# EAGLE design Analog-Mux-Breakout-v10 (EAGLE 6.2)
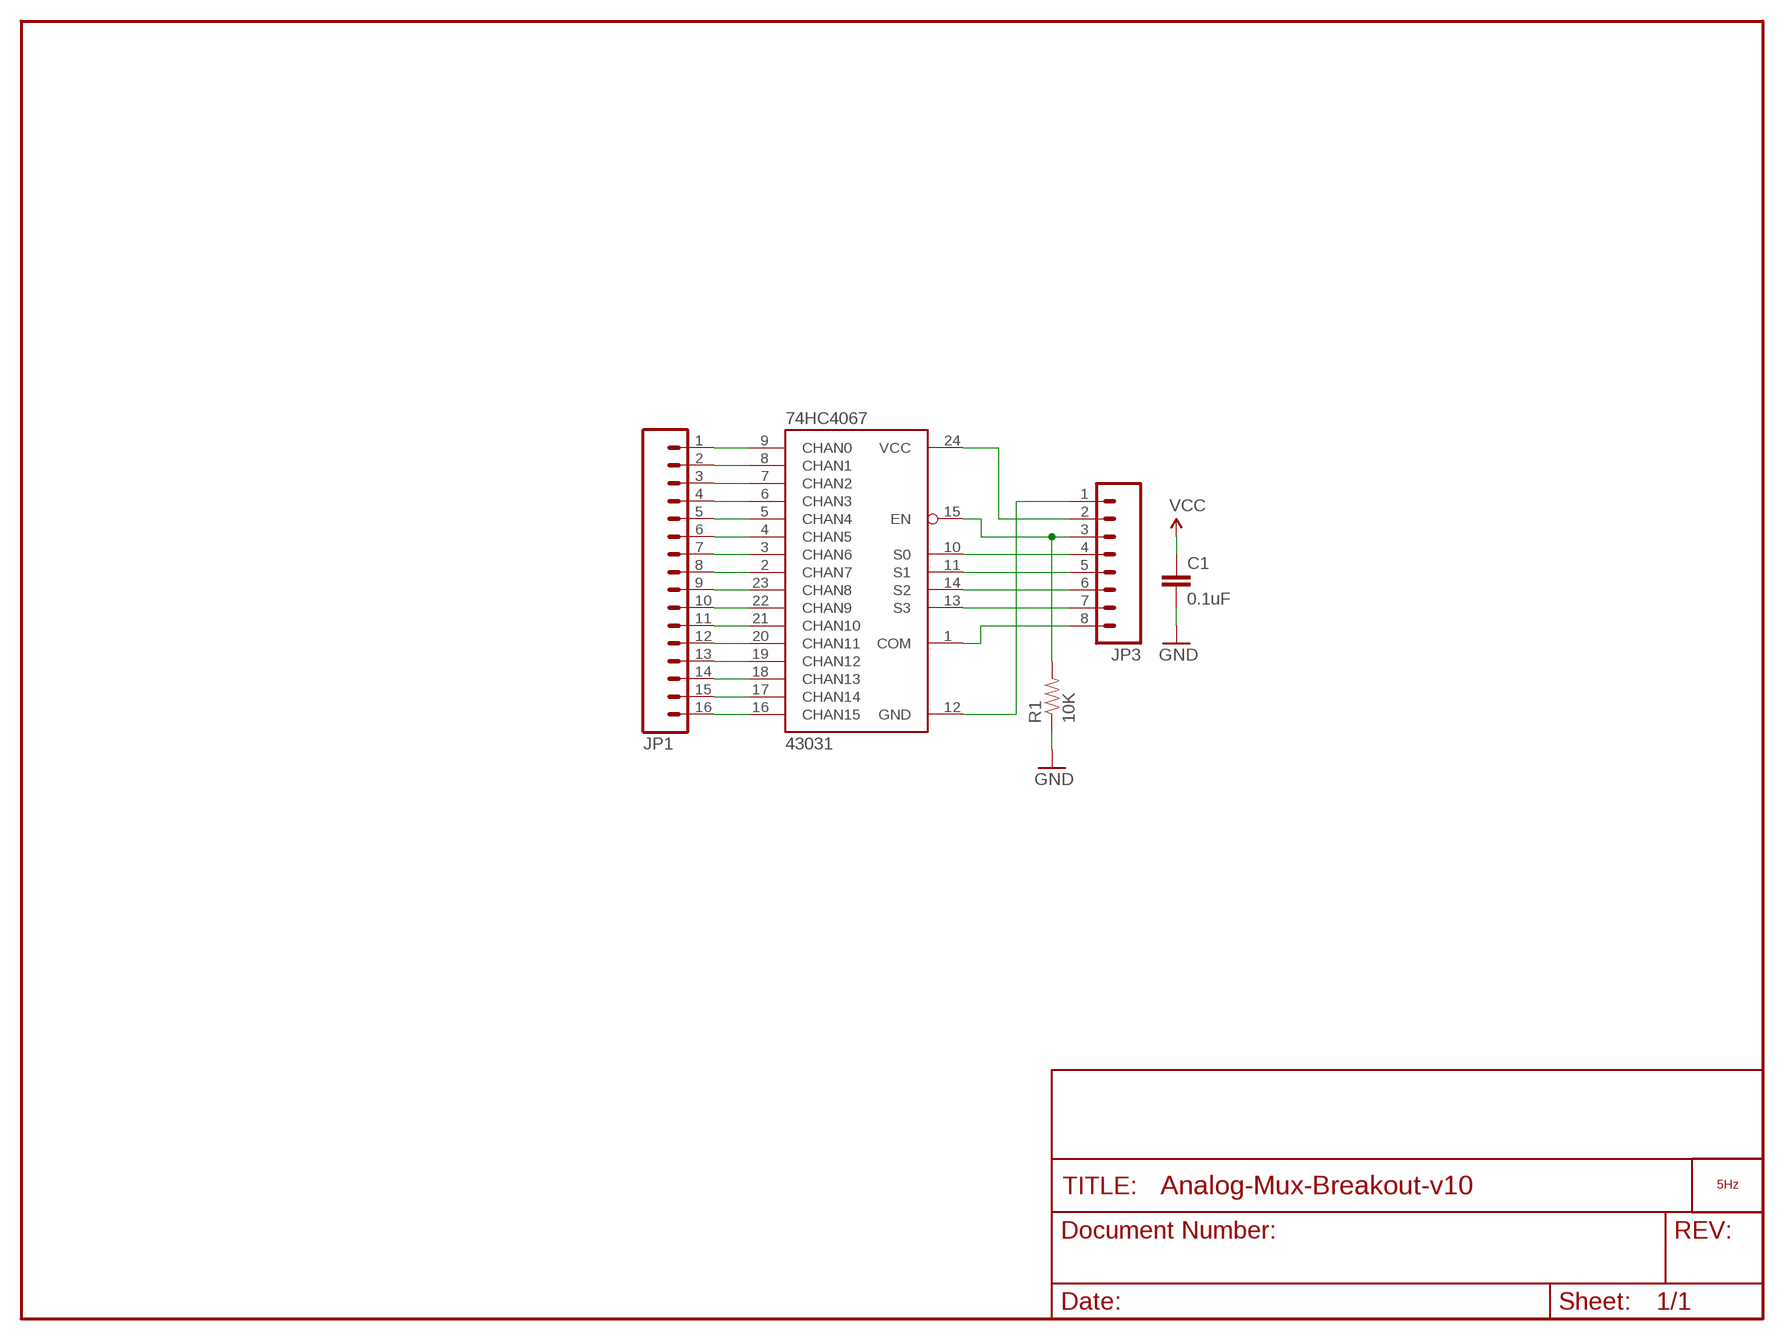
[diagram p0: schematic, sheet 1]

## Parts
74HC4067  43031  MUX-74HC4067SMD  [SSOP24]
C1  0.1uF  CAP0402  [C0402]
JP1  M16PTH  [1X16]
JP3  M08  [1X08]
LOGO1  LOGO_5HZ_H_10MM  [5HZ_LOGO_H_10MM]
R1  10K  RESISTOR0402  [C0402]

## Nets
C0: 74HC4067.9(CHAN0) JP1.1
C1: 74HC4067.8(CHAN1) JP1.2
C2: 74HC4067.7(CHAN2) JP1.3
C3: 74HC4067.6(CHAN3) JP1.4
C4: 74HC4067.5(CHAN4) JP1.5
C5: 74HC4067.4(CHAN5) JP1.6
C6: 74HC4067.3(CHAN6) JP1.7
C7: 74HC4067.2(CHAN7) JP1.8
C8: 74HC4067.23(CHAN8) JP1.9
C9: 74HC4067.22(CHAN9) JP1.10
C10: 74HC4067.21(CHAN10) JP1.11
C11: 74HC4067.20(CHAN11) JP1.12
C12: 74HC4067.19(CHAN12) JP1.13
C13: 74HC4067.18(CHAN13) JP1.14
C14: 74HC4067.17(CHAN14) JP1.15
C15: 74HC4067.16(CHAN15) JP1.16
EN: 74HC4067.15(EN) JP3.3 R1.2
GND: 74HC4067.12(GND) C1.2 JP3.1 R1.1
S0: 74HC4067.10(S0) JP3.4
S1: 74HC4067.11(S1) JP3.5
S2: 74HC4067.14(S2) JP3.6
S3: 74HC4067.13(S3) JP3.7
SIG: 74HC4067.1(COM) JP3.8
VCC: 74HC4067.24(VCC) C1.1 JP3.2

## Library data of the parts
74HC4067 = SparkFun:MUX-74HC4067
C1 = SparkFun:CAP: Capacitor Standard 0603 ceramic capacitor, and 0.1" leaded capacitor.
JP1 = SparkFun:M16
JP3 = SparkFun:M08: Header 8 Standard 8-pin 0.1" header. Use with straight break away headers (SKU : PRT-00116), right angle break away headers (PRT-00553), swiss pins (PRT-00743), machine pins (PRT-00117), and female headers (PRT-00115).
LOGO1 = 5hz-electronica:LOGO_5HZ: Logotipo 5Hz "según Pedro"
R1 = SparkFun:RESISTOR: Resistor Basic schematic elements and footprints for 0603, 1206, and PTH 1/10th watt (small) resistors.

## Board
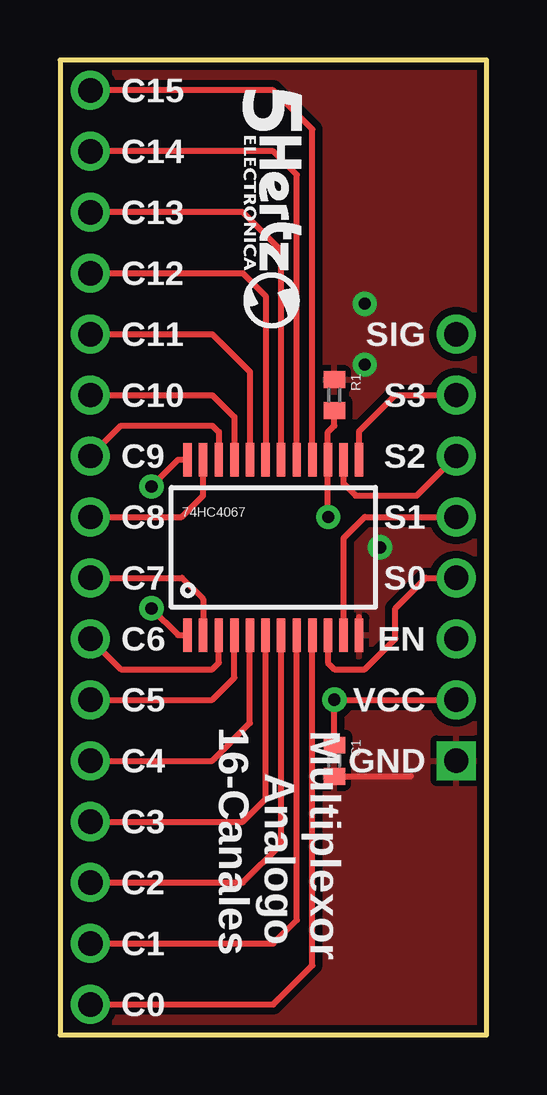
[diagram p1: board, top side]
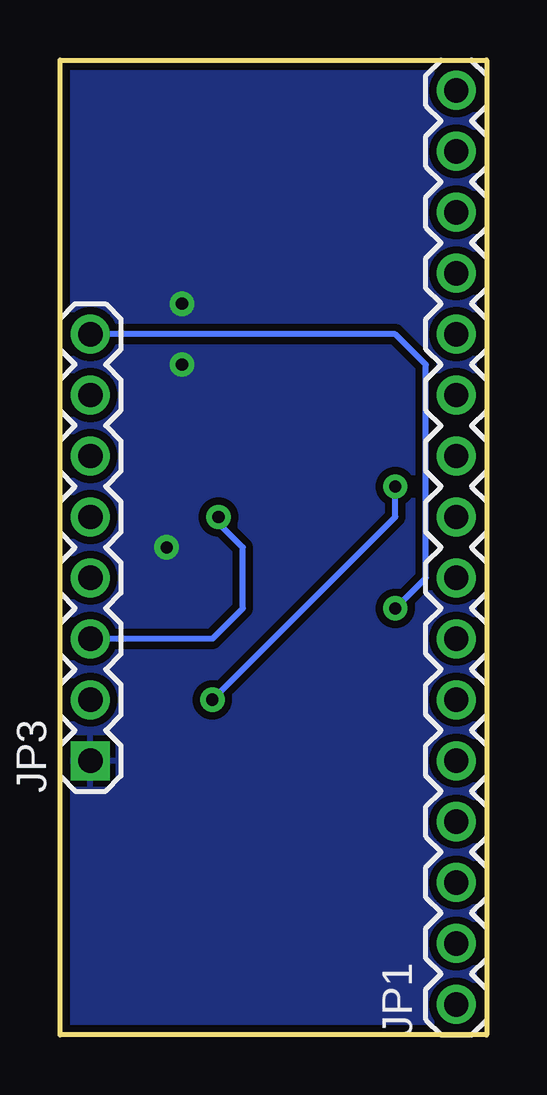
[diagram p2: board, bottom side, seen from below]

Size 17.78 x 40.64 mm. Coordinates in mm from the lower left corner, seen from the top.
Outline: 0,0 17.78,0 17.78,40.64 0,40.64 0,0
Copper layers (1*16): Top 0.035mm / dielectric 1.5mm / Bottom 0.035mm
Design rules: minimum track width 8mil, minimum drill 20mil, track to track 8mil, track to pad 8mil, pad to pad 8mil, via to via 8mil, smd to smd 8mil, copper to edge 10mil, drill to drill 8mil, minimum pad ring 12mil, minimum via ring 10mil, stop-mask expansion 4mil, vias tented up to drill 25mil, thermal gap 10mil

### Footprints (pad centres in the part's own frame; a part is rotated, then mirrored left to right if it is on the bottom)
SSOP24 = smd 0.348 x 1.397: 1 -3.575,-3.656; 2 -2.925,-3.656; 3 -2.275,-3.656; 4 -1.625,-3.656; 5 -0.975,-3.656; 6 -0.325,-3.656; 7 0.325,-3.656; 8 0.975,-3.656; 9 1.625,-3.656; 10 2.275,-3.656; 11 2.925,-3.656; 12 3.575,-3.656; 13 3.575,3.656; 14 2.925,3.656; 15 2.275,3.656; 16 1.625,3.656; 17 0.975,3.656; 18 0.325,3.656; 19 -0.325,3.656; 20 -0.975,3.656; 21 -1.625,3.656; 22 -2.275,3.656; 23 -2.925,3.656; 24 -3.575,3.656
C0402 = smd 0.7 x 0.9: 1 -0.65,0; 2 0.65,0
1X16 = drill 1.016: 1 0,0; 2 2.54,0; 3 5.08,0; 4 7.62,0; 5 10.16,0; 6 12.7,0; 7 15.24,0; 8 17.78,0; 9 20.32,0; 10 22.86,0; 11 25.4,0; 12 27.94,0; 13 30.48,0; 14 33.02,0; 15 35.56,0; 16 38.1,0
1X08 = drill 1.016 square: 1 0,0 | drill 1.016: 2 2.54,0; 3 5.08,0; 4 7.62,0; 5 10.16,0; 6 12.7,0; 7 15.24,0; 8 17.78,0

### Placement (x,y rotation side)
74HC4067  8.89,20.32 0 top
C1  11.43,11.43 270 top
JP1  1.27,1.27 90 bottom
JP3  16.51,11.43 90 bottom
LOGO1  7.62,39.37 270 top
R1  11.43,26.67 270 top

### Tracks (layer width: path | path; a pad name or v marks a point on that pad's centre or on a via)
C0
  Top 0.254: 74HC4067.9 10.52,2.9 8.89,1.27 JP1.1
C1
  Top 0.254: 74HC4067.8 9.87,4.79 8.89,3.81 JP1.2
C2
  Top 0.254: 74HC4067.7 9.21,7.95 7.62,6.35 JP1.3
C3
  Top 0.254: 74HC4067.6 8.56,9.84 7.62,8.89 JP1.4
C4
  Top 0.254: 74HC4067.5 7.92,12.99 6.35,11.43 JP1.5
C5
  Top 0.254: 74HC4067.4 7.26,14.88 6.35,13.97 JP1.6
C6
  Top 0.254: 74HC4067.3 6.62,15.51 6.35,15.24 2.54,15.24 JP1.7
C7
  Top 0.254: 74HC4067.2 5.96,18.16 5.08,19.05 JP1.8
C8
  Top 0.254: 74HC4067.23 5.96,22.48 5.08,21.59 JP1.9
C9
  Top 0.254: 74HC4067.22 6.62,25.14 6.35,25.4 2.54,25.4 JP1.10
C10
  Top 0.254: 74HC4067.21 7.26,25.75 6.35,26.67 JP1.11
C11
  Top 0.254: 74HC4067.20 7.92,27.64 6.35,29.21 JP1.12
C12
  Top 0.254: 74HC4067.19 8.56,30.8 7.62,31.75 JP1.13
C13
  Top 0.254: 74HC4067.18 9.21,32.7 7.62,34.29 JP1.14
C14
  Top 0.254: 74HC4067.17 9.87,35.85 8.89,36.83 JP1.15
C15
  Top 0.254: 74HC4067.16 10.52,37.74 8.89,39.37 JP1.16
EN  (via drill 0.51)
  Top 0.254: R1.2 11.43,25.4 11.16,25.14 74HC4067.15 11.16,21.6 v11.18,21.59
  Bottom 0.254: JP3.3 11.43,16.51 10.16,17.78 10.16,20.32 11.18,21.34 v11.18,21.59
GND  (via drill 0.51)
  Top 0.254: 74HC4067.12 12.46,17.42 | C1.2 14.62,10.78
  other vias: 13.34,20.32 12.7,27.94 12.7,30.48
  pour Bottom (isolate 0.305): 0,0 0,40.64 17.78,40.64 17.78,0
  pour Top (isolate 0.305): 0,0 0,40.64 17.78,40.64 17.78,0
S0
  Top 0.254: 74HC4067.10 11.16,15.51 11.43,15.24 12.7,15.24 13.97,16.51 13.97,17.78 15.24,19.05 JP3.4
S1
  Top 0.254: 74HC4067.11 11.81,20.7 12.7,21.59 JP3.5
S2
  Top 0.254: 74HC4067.14 11.81,22.98 12.32,22.48 14.86,22.48 JP3.6
S3
  Top 0.254: 74HC4067.13 12.46,25.16 13.97,26.67 JP3.7
SIG  (via drill 0.51)
  Top 0.254: 74HC4067.1 4.93,16.66 v3.81,17.78
  Bottom 0.254: JP3.8 3.81,29.21 2.54,27.94 2.54,19.05 v3.81,17.78
VCC  (via drill 0.51)
  Top 0.254: C1.1 v11.43,13.97 JP3.2 | 74HC4067.24 4.93,23.98 v3.81,22.86
  Bottom 0.254: v11.43,13.97 3.81,21.59 v3.81,22.86

### Text on the board
tPlace: C15 | C14 | C13 | C12 | SIG | C11 | S3 | C10 | S2 | C9 | S1 | C8 | S0 | C7 | EN | C6 | VCC | C5 | 16-Canales | Multiplexor | GND | C4 | Analogo | C3 | C2 | C1 | C0